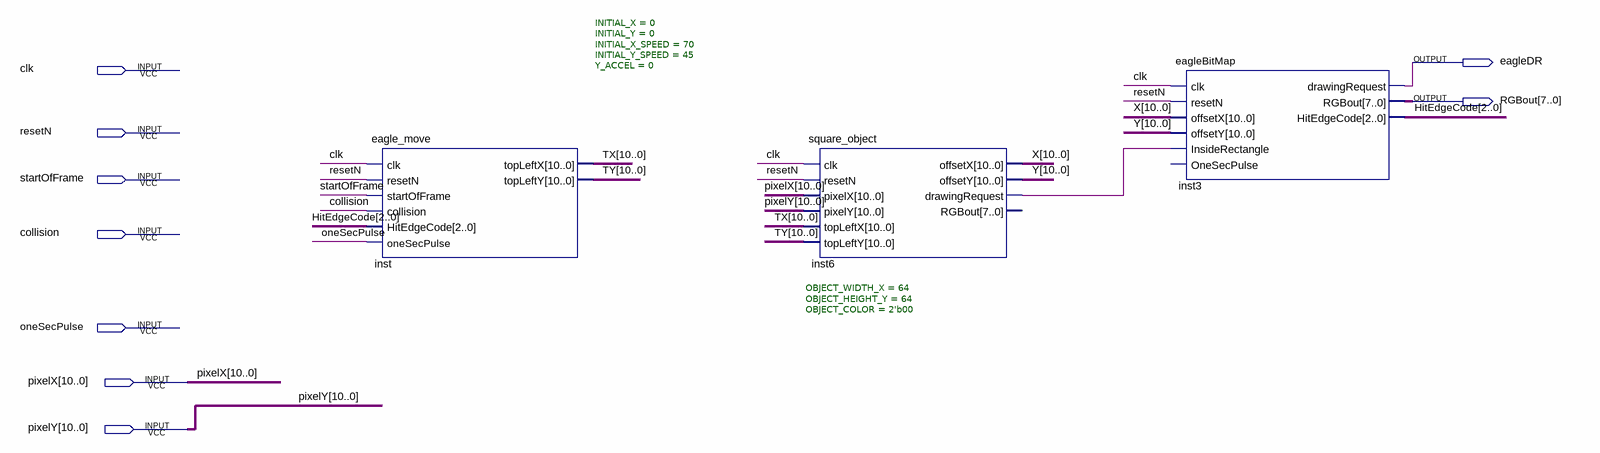
[diagram p0: schematic sheet]
// Quartus schematic eagleBlock_T.bdf as structural Verilog: 3 symbols, 9 pins
module eagleBlock_T (
  input  clk,
  input  resetN,
  input  startOfFrame,
  input  collision,
  input  oneSecPulse,
  input  [10:0] pixelX,
  input  [10:0] pixelY,
  output eagleDR,
  output [7:0] RGBout
);

  wire inst6_drawingrequest;
  wire [2:0] HitEdgeCode;
  wire [10:0] TX, TY, X, Y;

  eagle_move #(.INITIAL_X(0), .INITIAL_Y(0), .INITIAL_X_SPEED(70), .INITIAL_Y_SPEED(45), .Y_ACCEL(0)) inst (
    .clk(clk), .resetN(resetN), .startOfFrame(startOfFrame), .collision(collision),
    .HitEdgeCode(HitEdgeCode), .oneSecPulse(oneSecPulse), .topLeftX(TX), .topLeftY(TY));
  square_object #(.OBJECT_WIDTH_X(64), .OBJECT_HEIGHT_Y(64), .OBJECT_COLOR(2'b00)) inst6 (
    .clk(clk), .resetN(resetN), .pixelX(pixelX), .pixelY(pixelY), .topLeftX(TX), .topLeftY(TY), .offsetX(X),
    .offsetY(Y), .drawingRequest(inst6_drawingrequest));  // open: RGBout
  eagleBitMap inst3 (
    .clk(clk), .resetN(resetN), .offsetX(X), .offsetY(Y), .InsideRectangle(inst6_drawingrequest),
    .drawingRequest(eagleDR), .RGBout(RGBout), .HitEdgeCode(HitEdgeCode));  // open: OneSecPulse
endmodule
